# Altium schematic sheet Drivers.SchDoc
size A4; SheetNumber: 5; SheetTotal: 5
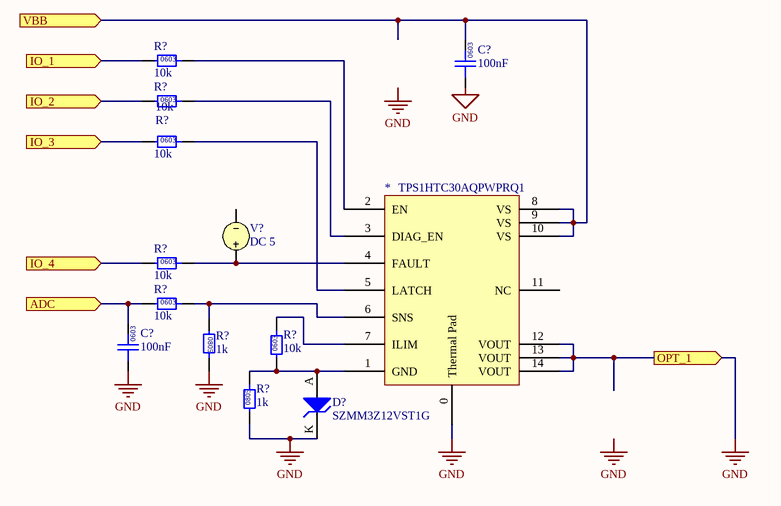
[diagram p0: Drivers.SchDoc]

## Parts
(Parts that share a designator on the sheet are numbered #1, #2 ... from top to bottom, then left to right.)
*  TPS1HTC30AQPWPRQ1  [TI_TSSOP]
C?#1  100nF  [0603]
C?#2  100nF  [0603]
D?  SZMM3Z12VST1G  [ON SOD323]
R?#1  10k  [0603]
R?#2  10k  [0603]
R?#3  10k  [0603]
R?#4  10k  [0603]
R?#5  10k  [0603]
R?#6  1k  [0805]
R?#7  10k  [0603]
R?#8  1k  [0805]
V?  DC 5

## Ports
ADC (in), IO_1 (in), IO_2 (in), IO_3 (in), IO_4 (in), OPT_1 (out), VBB (in)

## Nets
GND: *.0(Thermal_Pad) *.12(VOUT) *.13(VOUT) *.14(VOUT) C?#1.1 C?#2.1 D?.K R?#6.2 R?#8.1 ; port OPT_1
ADC: C?#2.2 R?#5.1 ; port ADC
IO_1: R?#1.1 ; port IO_1
IO_2: R?#2.1 ; port IO_2
IO_3: R?#3.1 ; port IO_3
IO_4: R?#4.1 ; port IO_4
VBB: *.8(VS) *.9(VS) *.10(VS) C?#1.2 ; port VBB
Net*_1: *.1(GND) D?.A R?#7.1 R?#8.2
Net*_2: *.2(EN) R?#1.2
Net*_3: *.3(DIAG_EN) R?#2.2
Net*_4: *.4(FAULT) R?#4.2 V?.1
Net*_5: *.5(LATCH) R?#3.2
Net*_6: *.6(SNS) R?#5.2 R?#6.1
Net*_7: *.7(ILIM) R?#7.2

Not connected (* = marked no-connect by the designer): * 11(NC); V? 2

## Notes on the sheet
- Labels drawn without touching a wire or pin: GND
- (in symbol GCM188L81H104KA57D) 0603
- (in symbol RC0603FR-0710KL) 0603
- (in symbol RC0805FR071KL) 0805

## Library data of the parts
* = TPS1HTC30AQPWPRQ1: AUTOMOTIVE, 60-V, 6-A, 30-M, ONE; Manufacturer: Texas Instruments; Complex IC: 1; Part Number: TPS1HTC30AQPWPRQ1; Digikey Part Number: 296-TPS1HTC30AQPWPRQ1TR-ND; Digikey Link: https://www.digikey.com.au/en/products/detail/texas-instruments/TPS1HTC30AQPWPRQ1/22106757
C?#1 C?#2 = GCM188L81H104KA57D: Manufacturer: muRata; Rated Voltage: 50V; Tolerance: ±10%; Material: MLCC; Temperature Rating: X8L; Part Number: GCM188L81H104KA57D; Value: 100nF; Digikey Part Number: 490-6049-1-ND
D? = SZMM3Z12VST1G: Manufacturer: onsemi; Breakdown Voltage: 12 V; Rated Power: 300 mW; Part Number: SZMM3Z12VST1G; Digikey Part Number: SZMM3Z12VST1GOSCT-ND
R?#1-R?#5 R?#7 = RC0603FR-0710KL: Manufacturer: YAGEO; Tolerance: 0.01; Rated Power: 0.1W; Part Number: RC0603FR-0710KL; Value: 10k; Material: FR-07; Digikey Part Number: 311-10.0KHRCT-ND
R?#6 R?#8 = RC0805FR071KL: Manufacturer: YAGEO; Tolerance: 0.01; Rated Power: 0.125W; Part Number: RC0805FR071KL; Value: 1k; Material: FR-07; Digikey Part Number: 311-1.00KCRCT-ND
V? = VSRC: Voltage Source; Note: PCB Footprint - Not required; AC Magnitude: 1; AC Phase: 0; Value: 5; Published: 8-Jun-2000; LatestRevisionDate: 17-Jul-2002; LatestRevisionNote: Re-released for DXP Platform.; PackageReference: Not Applicable; Publisher: Altium Limited